# Altium project Acoustics.PrjPcb
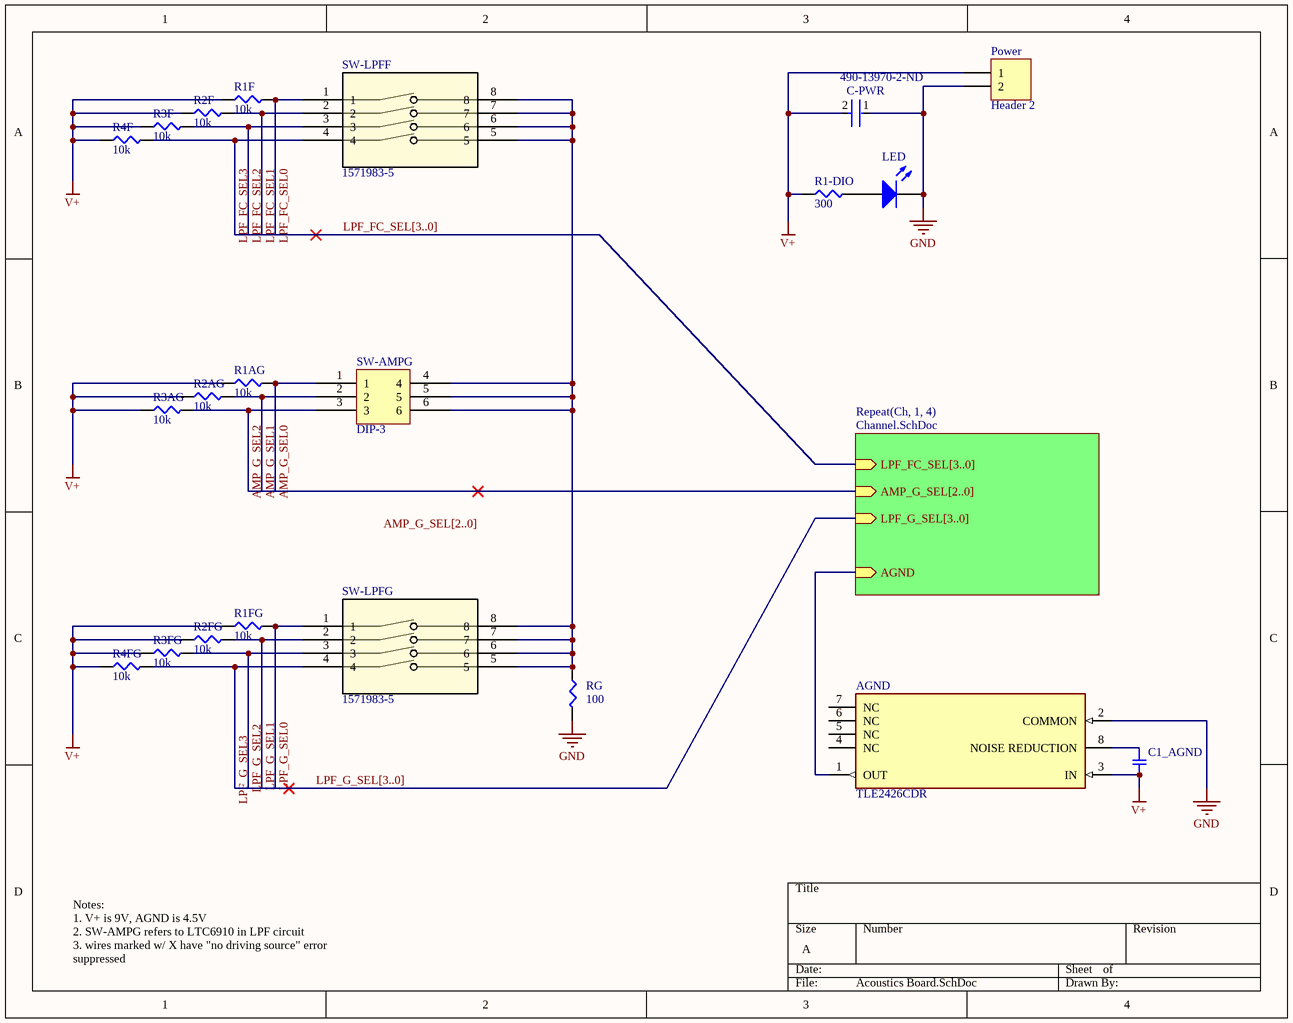
[diagram p0: Acoustics Board.SchDoc]
6 sheets, 117 parts. Net scope: hierarchical (ports join the sheet entries above them; power ports are global).
Board file: Acoustics Board.PcbDoc
Sheets:
  Acoustics Board.SchDoc
    Ch1 = Channel.SchDoc
      LPF = Low Pass Filter.SchDoc
      HPF = High Pass Filter.SchDoc
      BB = BufferBias.SchDoc
      Amp = AmpCKT.SchDoc
    Ch2 = Channel.SchDoc
      LPF = Low Pass Filter.SchDoc
      HPF = High Pass Filter.SchDoc
      BB = BufferBias.SchDoc
      Amp = AmpCKT.SchDoc
    Ch3 = Channel.SchDoc
      LPF = Low Pass Filter.SchDoc
      HPF = High Pass Filter.SchDoc
      BB = BufferBias.SchDoc
      Amp = AmpCKT.SchDoc
    Ch4 = Channel.SchDoc
      LPF = Low Pass Filter.SchDoc
      HPF = High Pass Filter.SchDoc
      BB = BufferBias.SchDoc
      Amp = AmpCKT.SchDoc

## Sheet Acoustics Board.SchDoc
size A

### Parts
AGND  TLE2426CDR  [FP-D0008A-IPC_B]
C1_AGND  1µF  [SMD-0805C]  (value not drawn)
C-PWR  Supplier Part Number 1: 490-13970-2-ND  [FP-GRM31C-0_3-e0_3_0_9-IPC_C]  (hidden comment: GRM31CR60J227ME11L)
LED  150080SS75000  [0805_A]  (value not drawn)
Power  Header 2  [HDR1X2]
R1-DIO  300  [SMD-0805-RES]
R1AG  10k  [SMD-0805-RES]
R1F  10k  [SMD-0805-RES]
R1FG  10k  [SMD-0805-RES]
R2AG  10k  [SMD-0805-RES]
R2F  10k  [SMD-0805-RES]
R2FG  10k  [SMD-0805-RES]
R3AG  10k  [SMD-0805-RES]
R3F  10k  [SMD-0805-RES]
R3FG  10k  [SMD-0805-RES]
R4F  10k  [SMD-0805-RES]
R4FG  10k  [SMD-0805-RES]
RG  100  [SMD-0805-RES]
SW-AMPG  DIP-3  [DIP6]
SW-LPFF  1571983-5  [SW4_1571983_4P_TEC]
SW-LPFG  1571983-5  [SW4_1571983_4P_TEC]

### Sub-sheets
Repeat(Ch, 1, 4) = Channel.SchDoc: LPF_FC_SEL[3..0] (in), AMP_G_SEL[2..0] (in), LPF_G_SEL[3..0] (in), AGND (in)

### Nets
GND: AGND.2(COMMON) C-PWR.1 LED.1(K) Power.2 RG.2
V+: AGND.3(IN) C1_AGND.2 C-PWR.2 Power.1 R1-DIO.1 R1AG.1 R1F.1 R1FG.1 R2AG.1 R2F.1 R2FG.1 R3AG.1 R3F.1 R3FG.1 R4F.1 R4FG.1
AMP_G_SEL0: R1AG.2 SW-AMPG.1
AMP_G_SEL1: R2AG.2 SW-AMPG.2
AMP_G_SEL2: R3AG.2 SW-AMPG.3
LPF_FC_SEL0: R1F.2 SW-LPFF.1
LPF_FC_SEL1: R2F.2 SW-LPFF.2
LPF_FC_SEL2: R3F.2 SW-LPFF.3
LPF_FC_SEL3: R4F.2 SW-LPFF.4
LPF_G_SEL0: R1FG.2 SW-LPFG.1
LPF_G_SEL1: R2FG.2 SW-LPFG.2
LPF_G_SEL2: R3FG.2 SW-LPFG.3
LPF_G_SEL3: R4FG.2 SW-LPFG.4
NetAGND_1: AGND.1(OUT) ; sheet Repeat(Ch, 1, 4)/AGND
NetAGND_8: AGND.8(NOISE_REDUCTION) C1_AGND.1
NetLED_2: LED.2(A) R1-DIO.2
NetRG_1: RG.1 SW-AMPG.4 SW-AMPG.5 SW-AMPG.6 SW-LPFF.5 SW-LPFF.6 SW-LPFF.7 SW-LPFF.8 SW-LPFG.5 SW-LPFG.6 SW-LPFG.7 SW-LPFG.8

Not connected (* = marked no-connect by the designer): AGND 4(NC) 5(NC) 6(NC) 7(NC)

### Buses and harness runs
bus AMP_G_SEL[2..0]
bus LPF_FC_SEL[3..0] = sheet Repeat(Ch, 1, 4)/LPF_FC_SEL[3..0]
bus LPF_G_SEL[3..0] = sheet Repeat(Ch, 1, 4)/LPF_G_SEL[3..0]

### Notes on the sheet
- Notes:
  1. V+ is 9V, AGND is 4.5V
  2. SW-AMPG refers to LTC6910 in LPF circuit
  3. wires marked w/ X have "no driving source" error suppressed
- Labels drawn without touching a wire or pin: AMP_G_SEL[2..0]

### Library data of the parts
AGND = CMP-04916-000011-1: Ground Reference (Virtual) Voltage Reference IC Adjustable 2V 20 VV ±1% 20 mA 8-SOIC; Manufacturer: Texas Instruments; Manufacturer Part Number: TLE2426MD; Value: N/A; Operating Temperature: -55°C ~ 125°C; Datasheet Link: https://www.digikey.com/en/products/detail/texas-instruments/TLE2426MD/1676989; Package / Case: 8-SOIC; Descriptions: Ground Reference (Virtual) Voltage Reference IC Adjustable 2V 20 VV ±1% 20 mA 8-SOIC
C1_AGND = GCJ219R71C105KA01D: Manufacturer: KEMET; Manufacturer Part Number: C0805C105K3RAC7800; Descriptions: 1 µF ±10% 25V Ceramic Capacitor X7R 0805 (2012 Metric); Datasheet Link: https://api.kemet.com/component-edge/download/datasheet/C0805C105K3RACTU.pdf; Value: 1µF; Operating Temperature: -55°C ~ 125°C; Package / Case: 0805 (2012 Metric)
C-PWR = CMP-06035-000079-2: Chip Multilayer Ceramic Capacitors for General Purpose, 1206, 220uF, X5R, 15%, 20%, 6.3V; Manufacturer: Murata; Mount: Surface Mount; Width: 0.063inch; Voltage Rating: 6.3V; Packaging: Cut Tape; Dielectric: X5R; Capacitance: 220uF; Voltage Rating (DC): 6.3V; Case/Package: 1206; Thickness: 0.075inch; Tolerance: 20%; Max Operating Temperature: 85°C; Case Code (Metric): 3216; Min Operating Temperature: -55°C; Length: 0.126inch; REACH SVHC: No SVHC; Case Code (Imperial): 1206; Supplier 1: Digi-Key; Manufacturer Part Number: GRM31CR60J227ME11L; RoHS: Yes; Category: Ceramic Capacitors; Stock 1: 266877; Pricing 1: 2000=0.46209, 4000=0.44559, 10000=0.42909, 14000=0.42083 (USD); RoHS Compliant: Yes; ComponentLink1URL: http://www.farnell.com/datasheets/2867879.pdf?src-supplier=Farnell; ComponentLink1Description: http://www.farnell.com/datasheets/2867879.pdf?src-supplier=Farnell; ComponentLink2URL: http://search.murata.co.jp/Ceramy/image/img/A01X/partnumbering_e_01.pdf?src-supplier=Digi-Key; ComponentLink2Description: http://search.murata.co.jp/Ceramy/image/img/A01X/partnumbering_e_01.pdf?src-supplier=Digi-Key; ComponentLink3URL: http://search.murata.co.jp/Ceramy/image/img/A01X/G101/ENG/GRM31CR60J227ME11-01.pdf?src-supplier=Digi-Key; ComponentLink3Description: http://search.murata.co.jp/Ceramy/image/img/A01X/G101/ENG/GRM31CR60J227ME11-01.pdf?src-supplier=Digi-Key; ComponentLink4URL: http://www.farnell.com/datasheets/2867879.pdf?src-supplier=Element14; ComponentLink4Description: http://www.farnell.com/datasheets/2867879.pdf?src-supplier=Element14; ComponentLink5URL: http://www.farnell.com/datasheets/1957826.pdf?src-supplier=Newark; ComponentLink5Description: http://www.farnell.com/datasheets/1957826.pdf?src-supplier=Newark
LED = CMP-1426-00010-1: Red 630nm LED Indication - Discrete 1.9V 0805 (2012 Metric); Manufacturer: Wuerth Elektronik; Value: 1.9V; Operating Temperature: -40°C ~ 85°C; Manufacturer Part Number: 150080SS75000; Datasheet Link: https://www.we-online.com/katalog/datasheet/150080SS75000.pdf; Package / Case: 0805 (2012 Metric); Descriptions: Red 630nm LED Indication - Discrete 1.9V 0805 (2012 Metric)
R1-DIO = ERJ-6ENF1002V: Manufacturer: Stackpole Electronics Inc; Manufacturer Part Number: RNCF0805DTE300R; Descriptions: 300 Ohms ±0.5% 0.125W, 1/8W Chip Resistor 0805 (2012 Metric) Automotive AEC-Q200 Thin Film; Datasheet Link: https://www.seielect.com/catalog/sei-rncf.pdf; Value: 300; Operating Temperature: -55°C ~ 155°C; Package / Case: 0805 (2012 Metric)
R1AG R1F R1FG R2AG R2F R2FG R3AG R3F R3FG R4F R4FG = ERJ-6ENF1002V: Manufacturer: Panasonic Electronic Components; Manufacturer Part Number: RMCF0805JG10K0; Descriptions: 10 kOhms ±5% 0.125W, 1/8W Chip Resistor 0805 (2012 Metric) Automotive AEC-Q200 Thick Film; Datasheet Link: https://www.seielect.com/catalog/sei-rmcf_rmcp.pdf; Value: 10k; Operating Temperature: -55°C ~ 155°C; Package / Case: 0805 (2012 Metric)
RG = ERJ-P06F1000V: RES SMD 100 OHM 1% 1/2W 0805; Manufacturer: Panasonic Electronic Components; Factory Stock: 0; Unit Price (USD): 0.02534; @ qty: 1500; Minimum Quantity: 1; Power (Watts): 0.5W, 1/2W; Temperature Coefficient: ±100ppm/°C; Part Number: ERJ-P06F1000V; Datasheets: https://industrial.panasonic.com/cdbs/www-data/pdf/RDA0000/AOA0000C243.pdf; Image: //media.digikey.com/Renders/Panasonic%20Renders/ERJ-0805%20Pkg.jpg; Digi-Key Part Number: P16057CT-ND; Quantity Available: 28131; Packaging: Cut Tape (CT); Series: ERJ; Part Status: Active; Value: 100; Tolerance: ±1%; Composition: Thick Film; Features: Automotive AEC-Q200, Pulse Withstanding; Operating Temperature: -55°C ~ 155°C; Package / Case: 0805 (2012 Metric); Supplier Device Package: 0805; Size / Dimension: 0.079" L x 0.049" W (2.00mm x 1.25mm); Height - Seated (Max): 0.028" (0.70mm); Number of Terminations: 2; Failure Rate: -
SW-LPFF SW-LPFG = 1571983-5: No Description Available; Mfr_Name: TE Connectivity; Copyright: Copyright (C) 2022 Ultra Librarian. All rights reserved.; Manufacturer_Part_Number: 1571983-5; Digi-Key_Part_Number_1: 450-1762-1-ND; Digi-Key_Part_Number_2: 450-1762-2-ND; Digi-Key_Part_Number_3: 450-1762-6-ND; RefDes: RefDes; Type: DEV
Power = Header 2: Value: N/A; Package / Case: HDR1X2

## Sheet Channel.SchDoc
size A
Used 4 times, as channels Ch1, Ch2, Ch3, Ch4. Parts and nets are listed once, with the designators drawn on the sheet.
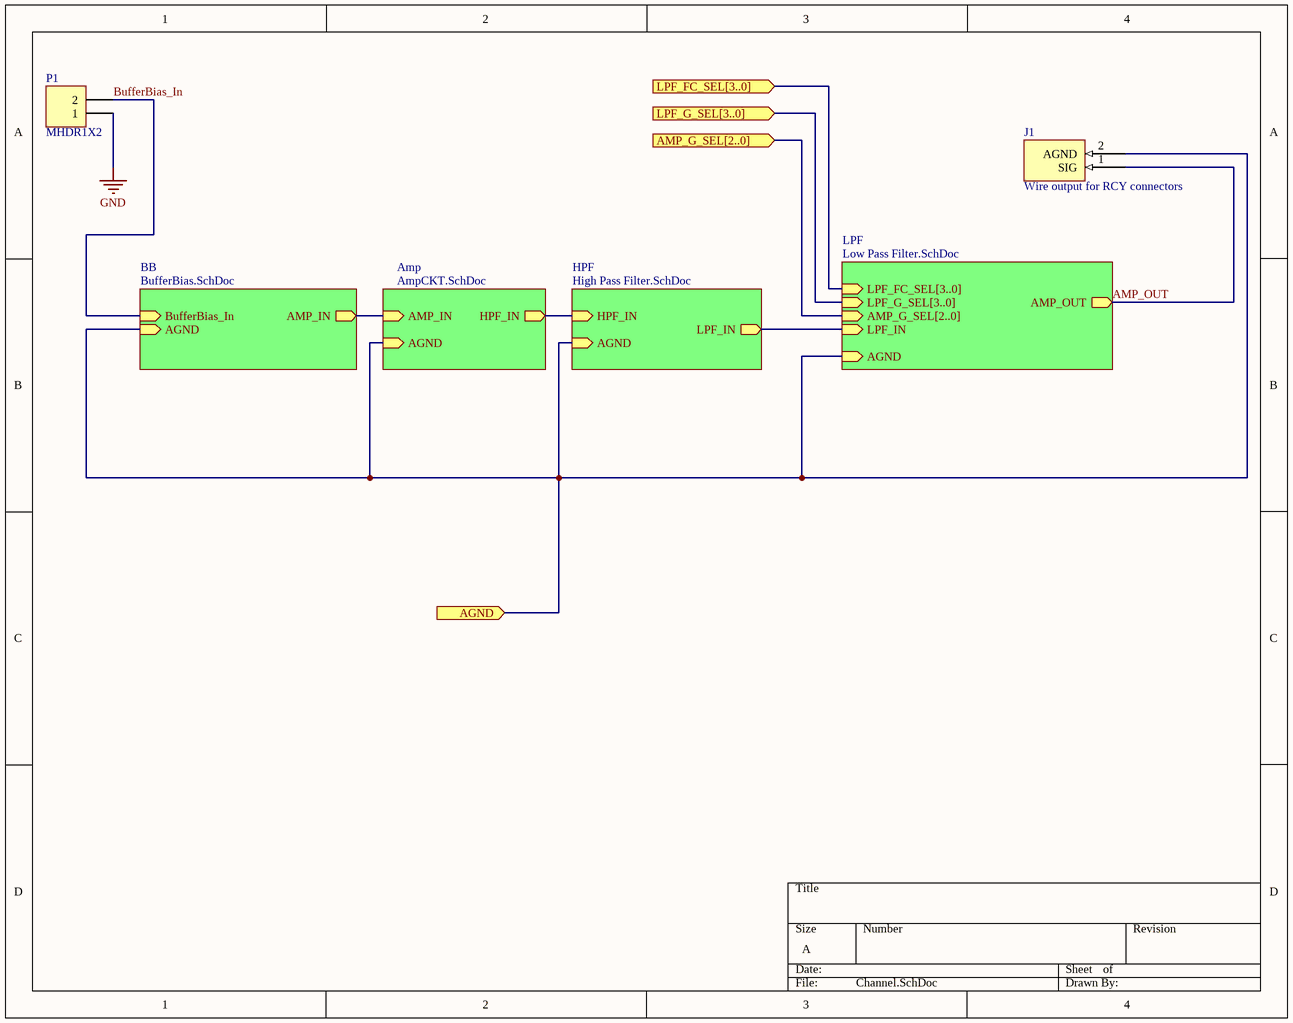
[diagram p1: Channel.SchDoc]

### Parts
J1  Wire output for RCY connectors  [WireOut]
P1  MHDR1X2  [MHDR1X2]

### Sub-sheets
Amp = AmpCKT.SchDoc: AMP_IN (in), AGND (in), HPF_IN (out)
BB = BufferBias.SchDoc: BufferBias_In (in), AGND (in), AMP_IN (out)
HPF = High Pass Filter.SchDoc: HPF_IN (in), AGND (in), LPF_IN (out)
LPF = Low Pass Filter.SchDoc: LPF_FC_SEL[3..0] (in), LPF_G_SEL[3..0] (in), AMP_G_SEL[2..0] (in), LPF_IN (in), AMP_OUT (out), AGND (in)

### Ports
AGND (in), AMP_G_SEL[2..0] (in), LPF_FC_SEL[3..0] (in), LPF_G_SEL[3..0] (in)

### Nets
GND: P1.1
AGND: J1.2(AGND) ; port AGND, sheet LPF/AGND, sheet HPF/AGND, sheet BB/AGND, sheet Amp/AGND
AMP_OUT: J1.1(SIG) ; sheet LPF/AMP_OUT
BufferBias_In: P1.2 ; sheet BB/BufferBias_In
(unnamed): sheet LPF/LPF_IN, sheet HPF/LPF_IN
(unnamed): sheet HPF/HPF_IN, sheet Amp/HPF_IN
(unnamed): sheet BB/AMP_IN, sheet Amp/AMP_IN

### Channels
Ch1: designators end in _Ch1; ports AGND=NetAGND_1
Ch2: designators end in _Ch2; ports AGND=NetAGND_1
Ch3: designators end in _Ch3; ports AGND=NetAGND_1
Ch4: designators end in _Ch4; ports AGND=NetAGND_1

### Buses and harness runs
bus port AMP_G_SEL[2..0] = sheet LPF/AMP_G_SEL[2..0]
bus port LPF_FC_SEL[3..0] = sheet LPF/LPF_FC_SEL[3..0]
bus port LPF_G_SEL[3..0] = sheet LPF/LPF_G_SEL[3..0]

### Library data of the parts
J1 = WireOut: Manufacturer: JST Sales America Inc.; Manufacturer Part Number: SYP-02T-1; Descriptions: 2 Rectangular Connectors - Housings Plug Red 0.098" (2.50mm); Value: N/A; Package / Case: N/A Through Hole; Datasheet Link: https://www.jst-mfg.com/product/pdf/eng/eRCY.pdf
P1 = MHDR1X2: Value: N/A; Package / Case: MHDR1X2

## Sheet Low Pass Filter.SchDoc
size A
Used 4 times, as channels Ch1/LPF, Ch2/LPF, Ch3/LPF, Ch4/LPF. Parts and nets are listed once, with the designators drawn on the sheet.
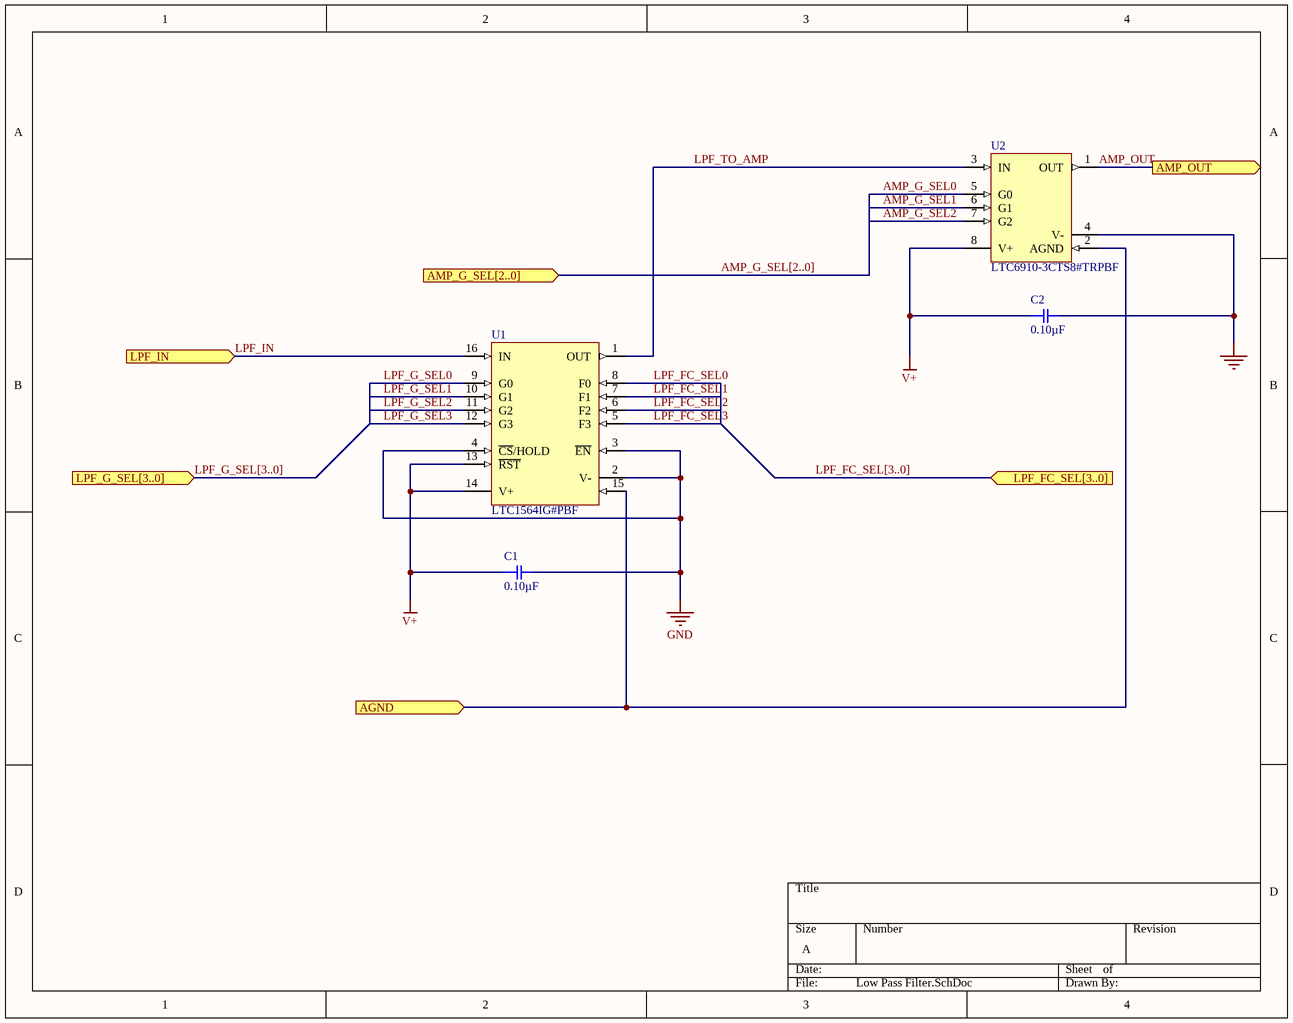
[diagram p2: Low Pass Filter.SchDoc]

### Parts
C1  0.10µF  [SMD-0805C]
C2  0.10µF  [SMD-0805C]
U1  LTC1564IG#PBF  [LT-G-16_M]
U2  LTC6910-3CTS8#TRPBF  [LT-TS8-8-TSOT-23_V]

### Ports
AGND (in), AMP_G_SEL[2..0] (in), AMP_OUT (out), LPF_FC_SEL[3..0] (in), LPF_G_SEL[3..0] (in), LPF_IN (in)

### Nets
GND: C1.2 C2.2 U1.2(V-) U1.3(~{EN}) U1.4(~{CS}/HOLD) U2.4(V-)
V+: C1.1 C2.1 U1.13(~{RST}) U1.14(V+) U2.8(V+)
AGND: U1.15(AGND) U2.2(AGND) ; port AGND
AMP_G_SEL0: U2.5(G0)
AMP_G_SEL1: U2.6(G1)
AMP_G_SEL2: U2.7(G2)
AMP_OUT: U2.1(OUT) ; port AMP_OUT
LPF_FC_SEL0: U1.8(F0)
LPF_FC_SEL1: U1.7(F1)
LPF_FC_SEL2: U1.6(F2)
LPF_FC_SEL3: U1.5(F3)
LPF_G_SEL0: U1.9(G0)
LPF_G_SEL1: U1.10(G1)
LPF_G_SEL2: U1.11(G2)
LPF_G_SEL3: U1.12(G3)
LPF_IN: U1.16(IN) ; port LPF_IN
LPF_TO_AMP: U1.1(OUT) U2.3(IN)

### Channels
Ch1/LPF: designators end in _LPF1; ports AGND=NetAGND_1 AMP_OUT=AMP_OUT_Ch1 LPF_IN=LPF_IN
Ch2/LPF: designators end in _LPF2; ports AGND=NetAGND_1 AMP_OUT=AMP_OUT_Ch2 LPF_IN=LPF_IN
Ch3/LPF: designators end in _LPF3; ports AGND=NetAGND_1 AMP_OUT=AMP_OUT_Ch3 LPF_IN=LPF_IN
Ch4/LPF: designators end in _LPF4; ports AGND=NetAGND_1 AMP_OUT=AMP_OUT_Ch4 LPF_IN=LPF_IN

### Buses and harness runs
bus AMP_G_SEL[2..0] = port AMP_G_SEL[2..0]
bus LPF_FC_SEL[3..0] = port LPF_FC_SEL[3..0]
bus LPF_G_SEL[3..0] = port LPF_G_SEL[3..0]

### Library data of the parts
C1 C2 = GCD21BR71H104KA01L: Manufacturer: KEMET; Manufacturer Part Number: C0805C104K3RAC7800; Descriptions: 0.1 µF ±10% 25V Ceramic Capacitor X7R 0805 (2012 Metric); Datasheet Link: https://api.kemet.com/component-edge/download/datasheet/C0805C104K3RACTU.pdf; Value: 0.10µF; Operating Temperature: -55°C ~ 125°C; Package / Case: 0805 (2012 Metric)
U1 = CMP-0359-00059-2: Manufacturer: Analog Devices Inc.; Descriptions: Antialiasing Filter IC Antialiasing 8th Order 150kHz 16-SSOP; RoHS: Pb-Free; Value: N/A; Operating Temperature: -40°C ~ 85°C; Datasheet Link: https://www.analog.com/media/en/technical-documentation/data-sheets/1564fa.pdf; Manufacturer Part Number: LTC1564IG#PBF; Package / Case: 16-SSOP
U2 = CMP-0359-03721-2: Manufacturer: Analog Devices Inc.; Manufacturer Part Number: LTC6910-3CTS8#TRMPBF; Descriptions: Programmable Gain Amplifier 1 Circuit Rail-to-Rail TSOT-23-8; RoHS: Pb-Free; Value: N/A; Operating Temperature: 0°C ~ 70°C; Datasheet Link: https://www.analog.com/media/en/technical-documentation/data-sheets/6910fb.pdf; Package / Case: TSOT-23-8

## Sheet High Pass Filter.SchDoc
size A
Used 4 times, as channels Ch1/HPF, Ch2/HPF, Ch3/HPF, Ch4/HPF. Parts and nets are listed once, with the designators drawn on the sheet.
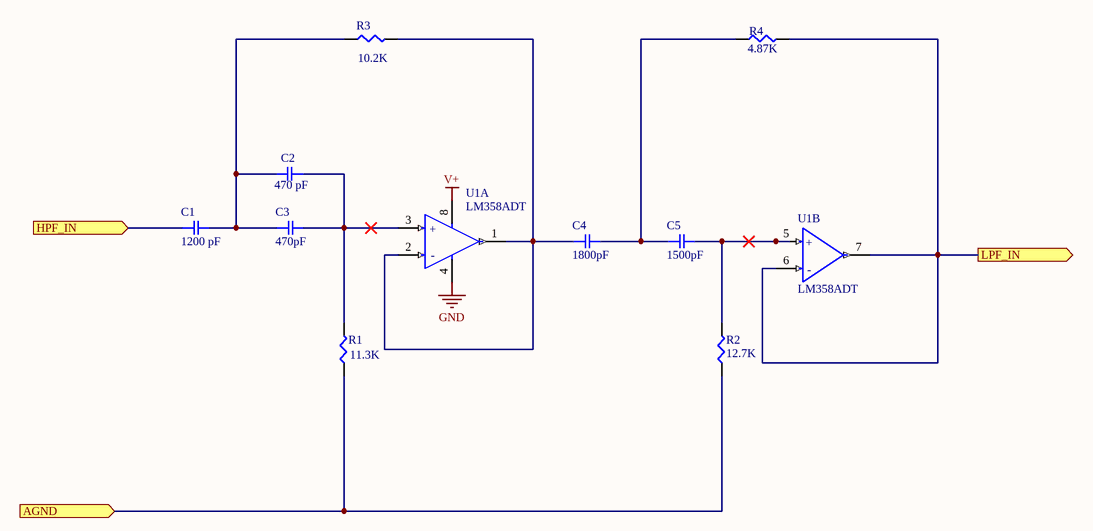
[diagram p3: High Pass Filter.SchDoc]

### Parts
C1  1200 pF  [SMD-0805C]
C2  470 pF  [SMD-0805C]
C3  470pF  [SMD-0805C]
C4  1800pF  [SMD-0805C]
C5  1500pF  [SMD-0805C]
R1  11.3K  [SMD-0805-RES]
R2  12.7K  [SMD-0805-RES]
R3  10.2K  [SMD-0805-RES]
R4  4.87K  [SMD-0805-RES]
U1  LM358ADT  [FP-SO8-IPC_C]  (parts A,B of 2)

### Ports
AGND (in), HPF_IN (in), LPF_IN (out)

### Nets
GND: U1.4(VCC-)
V+: U1.8(VCC+)
AGND: R1.1 R2.1 ; port AGND
HPF_IN: C1.1 ; port HPF_IN
LPF_IN: R4.2 U1.6(In2-) U1.7(Out2) ; port LPF_IN
NetC1_2: C1.2 C2.2 C3.1 R3.1
NetC2_1: C2.1 C3.2 R1.2 U1.3(In1+)
NetC4_1: C4.1 R3.2 U1.1(Out1) U1.2(In1-)
NetC4_2: C4.2 C5.1 R4.1
NetC5_2: C5.2 R2.2 U1.5(In2+)

### Channels
Ch1/HPF: designators end in _HPF1; ports AGND=NetAGND_1 HPF_IN=NetC1_HPF1_1 LPF_IN=LPF_IN
Ch2/HPF: designators end in _HPF2; ports AGND=NetAGND_1 HPF_IN=NetC1_HPF2_1 LPF_IN=LPF_IN
Ch3/HPF: designators end in _HPF3; ports AGND=NetAGND_1 HPF_IN=NetC1_HPF3_1 LPF_IN=LPF_IN
Ch4/HPF: designators end in _HPF4; ports AGND=NetAGND_1 HPF_IN=NetC1_HPF4_1 LPF_IN=LPF_IN

### Notes on the sheet
- (in symbol CMP-12131-000002-1, part A) +; -
- (in symbol CMP-12131-000002-1, part B) +; -

### Library data of the parts
C1 = GRM216R71E122KA01D: Manufacturer: KEMET; Manufacturer Part Number: C0805C122J2GAC7800; Value: 1200pF; Descriptions: 1200 pF ±5% 200V Ceramic Capacitor C0G, NP0 0805 (2012 Metric); Datasheet Link: https://api.kemet.com/component-edge/download/datasheet/C0805C122J2GAC7800.pdf; Operating Temperature: -55°C ~ 125°C; Package / Case: 0805 (2012 Metric)
C2 = GCM2165C1H471JA16D: Manufacturer: KEMET; Manufacturer Part Number: C0805C471J1GAC7800; Value: 470pF; Descriptions: 470 pF ±5% 100V Ceramic Capacitor C0G, NP0 0805 (2012 Metric); Datasheet Link: https://api.kemet.com/component-edge/download/datasheet/C0805C471J1GACTU.pdf; Operating Temperature: -55°C ~ 125°C; Package / Case: 0805 (2012 Metric)
C3 = GCM2165C1H471JA16D: Manufacturer: KEMET; Manufacturer Part Number: C0805C471J1GAC7800; Descriptions: 470 pF ±5% 100V Ceramic Capacitor C0G, NP0 0805 (2012 Metric); Datasheet Link: https://api.kemet.com/component-edge/download/datasheet/C0805C471J1GACTU.pdf; Value: 470pF; Operating Temperature: -55°C ~ 125°C; Package / Case: 0805 (2012 Metric)
C4 = GRM216R71E182KA01D: Manufacturer: KEMET; Manufacturer Part Number: C0805C182K5RAC7800; Descriptions: 1800 pF ±10% 50V Ceramic Capacitor X7R 0805 (2012 Metric); Datasheet Link: https://api.kemet.com/component-edge/download/datasheet/C0805C182K5RACTU.pdf; Value: 1800pF; Operating Temperature: -55°C ~ 125°C; Package / Case: 0805 (2012 Metric)
C5 = GCJ216R71H152KA01D: Manufacturer: KEMET; Manufacturer Part Number: C0805C152JAGAC7800; Descriptions: 1500 pF ±5% 250V Ceramic Capacitor C0G, NP0 0805 (2012 Metric); Datasheet Link: https://api.kemet.com/component-edge/download/datasheet/C0805C152JAGAC7800.pdf; Value: 1500pF; Operating Temperature: -55°C ~ 125°C; Package / Case: 0805 (2012 Metric)
R1 = ERJ-6ENF1132V: Manufacturer: Stackpole Electronics Inc; Manufacturer Part Number: RNCF0805DTE11K3; Descriptions: 11.3 kOhms ±0.5% 0.125W, 1/8W Chip Resistor 0805 (2012 Metric) Automotive AEC-Q200 Thin Film; Datasheet Link: https://www.seielect.com/catalog/sei-rncf.pdf; Value: 11.3k; Operating Temperature: -55°C ~ 155°C; Package / Case: 0805 (2012 Metric)
R2 = ERJ-6ENF1272V: Manufacturer: Stackpole Electronics Inc; Manufacturer Part Number: RNCF0805DTE12K7; Descriptions: 12.7 kOhms ±0.5% 0.125W, 1/8W Chip Resistor 0805 (2012 Metric) Automotive AEC-Q200 Thin Film; Datasheet Link: https://www.seielect.com/catalog/sei-rncf.pdf; Value: 12.7k; Operating Temperature: -55°C ~ 155°C; Package / Case: 0805 (2012 Metric)
R3 = ERJ-6ENF1022V: Manufacturer: Stackpole Electronics Inc; Manufacturer Part Number: RNCF0805DTE10K2; Descriptions: 10.2 kOhms ±0.5% 0.125W, 1/8W Chip Resistor 0805 (2012 Metric) Automotive AEC-Q200 Thin Film; Datasheet Link: https://www.seielect.com/catalog/sei-rncf.pdf; Value: 10.2k; Operating Temperature: -55°C ~ 155°C; Package / Case: 0805 (2012 Metric)
R4 = ERJ-6ENF4871V: Manufacturer: Stackpole Electronics Inc; Manufacturer Part Number: RMCF0805FT4K87; Descriptions: 4.87 kOhms ±1% 0.125W, 1/8W Chip Resistor 0805 (2012 Metric) Automotive AEC-Q200 Thick Film; Datasheet Link: https://www.seielect.com/catalog/sei-rmcf_rmcp.pdf; Value: 4.87k; Operating Temperature: -55°C ~ 155°C; Package / Case: 0805 (2012 Metric)
U1 = CMP-12131-000002-1: Manufacturer Part Number: LM358WDT; Manufacturer: STMicroelectronics; Descriptions: General Purpose Amplifier 2 Circuit - 8-SOIC; RoHS: TRUE; Value: N/A; Operating Temperature: 0°C ~ 70°C; Datasheet Link: https://www.st.com/content/ccc/resource/technical/document/datasheet/82/55/37/12/85/cc/4c/29/CD00003160.pdf/files/CD00003160.pdf/jcr:content/translations/en.CD00003160.pdf; Package / Case: 8-SOIC

## Sheet BufferBias.SchDoc
size A
Used 4 times, as channels Ch1/BB, Ch2/BB, Ch3/BB, Ch4/BB. Parts and nets are listed once, with the designators drawn on the sheet.
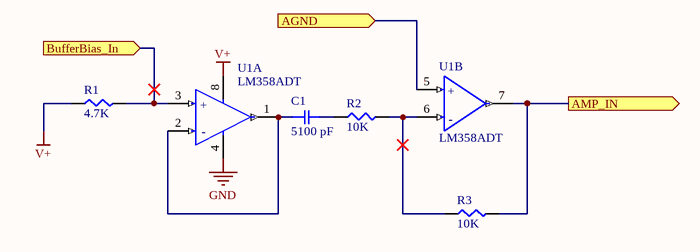
[diagram p4: BufferBias.SchDoc]

### Parts
C1  5100 pF  [SMD-0805C]
R1  4.7K  [SMD-0805-RES]
R2  10K  [SMD-0805-RES]
R3  10K  [SMD-0805-RES]
U1  LM358ADT  [FP-SO8-IPC_C]  (parts A,B of 2)

### Ports
AGND (in), AMP_IN (out), BufferBias_In (in)

### Nets
GND: U1.4(VCC-)
V+: R1.1 U1.8(VCC+)
AGND: U1.5(In2+) ; port AGND
AMP_IN: R3.2 U1.7(Out2) ; port AMP_IN
BufferBias_In: R1.2 U1.3(In1+) ; port BufferBias_In
NetC1_1: C1.1 U1.1(Out1) U1.2(In1-)
NetC1_2: C1.2 R2.1
NetR2_2: R2.2 R3.1 U1.6(In2-)

### Channels
Ch1/BB: designators end in _BB1; ports AGND=NetAGND_1 AMP_IN=NetR3_BB1_2 BufferBias_In=BufferBias_In_Ch1
Ch2/BB: designators end in _BB2; ports AGND=NetAGND_1 AMP_IN=NetR3_BB2_2 BufferBias_In=BufferBias_In_Ch2
Ch3/BB: designators end in _BB3; ports AGND=NetAGND_1 AMP_IN=NetR3_BB3_2 BufferBias_In=BufferBias_In_Ch3
Ch4/BB: designators end in _BB4; ports AGND=NetAGND_1 AMP_IN=NetR3_BB4_2 BufferBias_In=BufferBias_In_Ch4

### Notes on the sheet
- (in symbol CMP-12131-000002-1, part A) +; -
- (in symbol CMP-12131-000002-1, part B) +; -

### Library data of the parts
C1 = GRM2195C1H512JA01D: Manufacturer: KEMET; Manufacturer Part Number: C0805C512F4HACAUTO; Value: 5100pF; Descriptions: 5100 pF ±1% 16V Ceramic Capacitor X8R 0805 (2012 Metric); Datasheet Link: https://content.kemet.com/datasheets/KEM_C1007_X8R_ULTRA_150C_SMD.pdf; Operating Temperature: -55°C ~ 125°C; Package / Case: 0805 (2012 Metric)
R1 = ERJ-6ENF4701V: Manufacturer: Stackpole Electronics Inc; Manufacturer Part Number: RNCF0805DTE4K70; Descriptions: RES 4.7K OHM 0.5% 1/8W 0805; Datasheet Link: https://www.seielect.com/catalog/sei-rncf.pdf; Value: 4.7k; Operating Temperature: -55°C ~ 155°C; Package / Case: 0805 (2012 Metric)
R2 R3 = ERJ-6ENF1002V: Manufacturer: Stackpole Electronics Inc; Manufacturer Part Number: RMCF0805JG10K0; Descriptions: 10 kOhms ±5% 0.125W, 1/8W Chip Resistor 0805 (2012 Metric) Automotive AEC-Q200 Thick Film; Datasheet Link: https://www.seielect.com/catalog/sei-rmcf_rmcp.pdf; Value: 10k; Operating Temperature: -55°C ~ 155°C; Package / Case: 0805 (2012 Metric)
U1 = CMP-12131-000002-1: as U1 on sheet High Pass Filter; RoHS: TRUE; Value: N/A; Operating Temperature: 0°C ~ 70°C; Datasheet Link: https://www.st.com/content/ccc/resource/technical/document/datasheet/82/55/37/12/85/cc/4c/29/CD00003160.pdf/files/CD00003160.pdf/jcr:content/translations/en.CD00003160.pdf; Package / Case: 8-SOIC

## Sheet AmpCKT.SchDoc
size A
Used 4 times, as channels Ch1/Amp, Ch2/Amp, Ch3/Amp, Ch4/Amp. Parts and nets are listed once, with the designators drawn on the sheet.
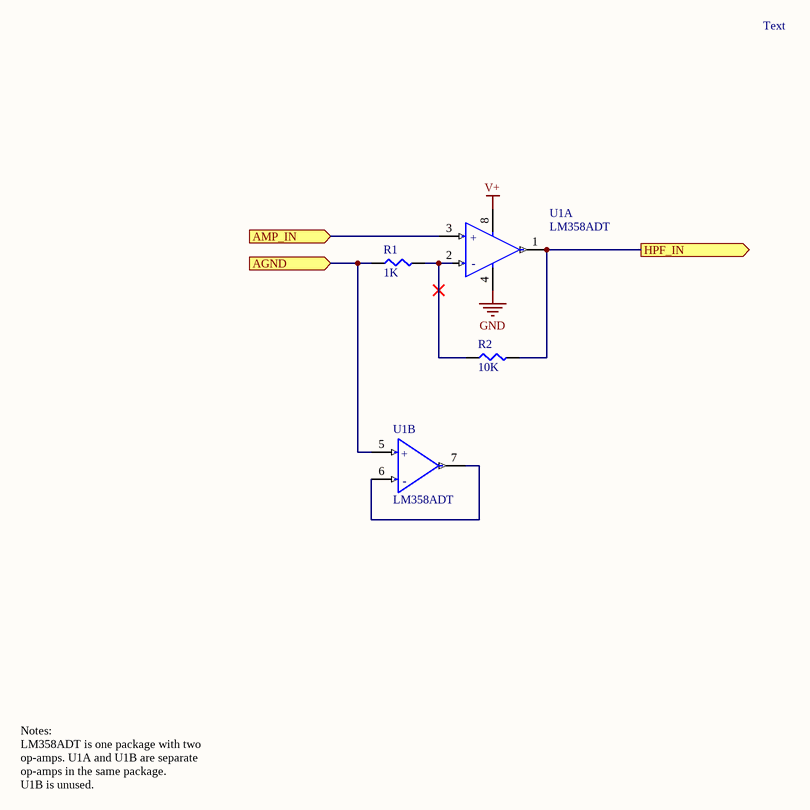
[diagram p5: AmpCKT.SchDoc]

### Parts
R1  1K  [SMD-0805-RES]
R2  10K  [SMD-0805-RES]
U1  LM358ADT  [FP-SO8-IPC_C]  (parts A,B of 2)

### Ports
AGND (in), AMP_IN (in), HPF_IN (out)

### Nets
GND: U1.4(VCC-)
V+: U1.8(VCC+)
AGND: R1.1 U1.5(In2+) ; port AGND
AMP_IN: U1.3(In1+) ; port AMP_IN
HPF_IN: R2.2 U1.1(Out1) ; port HPF_IN
NetR1_2: R1.2 R2.1 U1.2(In1-)
NetU1_6: U1.6(In2-) U1.7(Out2)

### Channels
Ch1/Amp: designators end in _Amp1; ports AGND=NetAGND_1 AMP_IN=NetR3_BB1_2 HPF_IN=NetC1_HPF1_1
Ch2/Amp: designators end in _Amp2; ports AGND=NetAGND_1 AMP_IN=NetR3_BB2_2 HPF_IN=NetC1_HPF2_1
Ch3/Amp: designators end in _Amp3; ports AGND=NetAGND_1 AMP_IN=NetR3_BB3_2 HPF_IN=NetC1_HPF3_1
Ch4/Amp: designators end in _Amp4; ports AGND=NetAGND_1 AMP_IN=NetR3_BB4_2 HPF_IN=NetC1_HPF4_1

### Notes on the sheet
- Text
- Notes:
  LM358ADT is one package with two op-amps. U1A and U1B are separate op-amps in the same package.
  U1B is unused.
- (in symbol CMP-12131-000002-1, part A) +; -
- (in symbol CMP-12131-000002-1, part B) +; -

### Library data of the parts
R1 = ERJ-6ENF1001V: Manufacturer: Stackpole Electronics Inc; Manufacturer Part Number: RMCF0805FT1K00; Descriptions: 1 kOhms ±1% 0.125W, 1/8W Chip Resistor 0805 (2012 Metric) Automotive AEC-Q200 Thick Film; Datasheet Link: https://www.seielect.com/catalog/sei-rmcf_rmcp.pdf; Value: 1k; Operating Temperature: -55°C ~ 155°C; Package / Case: 0805 (2012 Metric)
R2 = ERJ-6ENF1002V: as R2 on sheet BufferBias; Datasheet Link: https://www.seielect.com/catalog/sei-rmcf_rmcp.pdf; Value: 10k; Operating Temperature: -55°C ~ 155°C; Package / Case: 0805 (2012 Metric)
U1 = CMP-12131-000002-1: as U1 on sheet High Pass Filter; RoHS: TRUE; Operating Temperature: 0°C ~ 70°C; Datasheet Link: https://www.st.com/content/ccc/resource/technical/document/datasheet/82/55/37/12/85/cc/4c/29/CD00003160.pdf/files/CD00003160.pdf/jcr:content/translations/en.CD00003160.pdf; Package / Case: 8-SOIC

## Nets that join several sheets
GND: Acoustics Board (5 pins), Ch1 (P1_Ch1.1), Ch1/LPF (6 pins), Ch1/HPF (U1_HPF1.4), Ch1/BB (U1_BB1.4), Ch1/Amp (U1_Amp1.4), Ch2 (P1_Ch2.1), Ch2/LPF (6 pins), Ch2/HPF (U1_HPF2.4), Ch2/BB (U1_BB2.4), Ch2/Amp (U1_Amp2.4), Ch3 (P1_Ch3.1), Ch3/LPF (6 pins), Ch3/HPF (U1_HPF3.4), Ch3/BB (U1_BB3.4), Ch3/Amp (U1_Amp3.4), Ch4 (P1_Ch4.1), Ch4/LPF (6 pins), Ch4/HPF (U1_HPF4.4), Ch4/BB (U1_BB4.4), Ch4/Amp (U1_Amp4.4)
V+: Acoustics Board (16 pins), Ch1/LPF (5 pins), Ch1/HPF (U1_HPF1.8), Ch1/BB (R1_BB1.1 U1_BB1.8), Ch1/Amp (U1_Amp1.8), Ch2/LPF (5 pins), Ch2/HPF (U1_HPF2.8), Ch2/BB (R1_BB2.1 U1_BB2.8), Ch2/Amp (U1_Amp2.8), Ch3/LPF (5 pins), Ch3/HPF (U1_HPF3.8), Ch3/BB (R1_BB3.1 U1_BB3.8), Ch3/Amp (U1_Amp3.8), Ch4/LPF (5 pins), Ch4/HPF (U1_HPF4.8), Ch4/BB (R1_BB4.1 U1_BB4.8), Ch4/Amp (U1_Amp4.8)
AMP_G_SEL0: Ch1/LPF (U2_LPF1.5), Ch2/LPF (U2_LPF2.5), Ch3/LPF (U2_LPF3.5), Ch4/LPF (U2_LPF4.5)
AMP_G_SEL1: Ch1/LPF (U2_LPF1.6), Ch2/LPF (U2_LPF2.6), Ch3/LPF (U2_LPF3.6), Ch4/LPF (U2_LPF4.6)
AMP_G_SEL2: Ch1/LPF (U2_LPF1.7), Ch2/LPF (U2_LPF2.7), Ch3/LPF (U2_LPF3.7), Ch4/LPF (U2_LPF4.7)
AMP_OUT_Ch1: Ch1 (J1_Ch1.1), Ch1/LPF (U2_LPF1.1)
AMP_OUT_Ch2: Ch2 (J1_Ch2.1), Ch2/LPF (U2_LPF2.1)
AMP_OUT_Ch3: Ch3 (J1_Ch3.1), Ch3/LPF (U2_LPF3.1)
AMP_OUT_Ch4: Ch4 (J1_Ch4.1), Ch4/LPF (U2_LPF4.1)
BufferBias_In_Ch1: Ch1 (P1_Ch1.2), Ch1/BB (R1_BB1.2 U1_BB1.3)
BufferBias_In_Ch2: Ch2 (P1_Ch2.2), Ch2/BB (R1_BB2.2 U1_BB2.3)
BufferBias_In_Ch3: Ch3 (P1_Ch3.2), Ch3/BB (R1_BB3.2 U1_BB3.3)
BufferBias_In_Ch4: Ch4 (P1_Ch4.2), Ch4/BB (R1_BB4.2 U1_BB4.3)
LPF_FC_SEL0: Acoustics Board (R1F.2 SW-LPFF.1), Ch1/LPF (U1_LPF1.8), Ch2/LPF (U1_LPF2.8), Ch3/LPF (U1_LPF3.8), Ch4/LPF (U1_LPF4.8)
LPF_FC_SEL1: Acoustics Board (R2F.2 SW-LPFF.2), Ch1/LPF (U1_LPF1.7), Ch2/LPF (U1_LPF2.7), Ch3/LPF (U1_LPF3.7), Ch4/LPF (U1_LPF4.7)
LPF_FC_SEL2: Acoustics Board (R3F.2 SW-LPFF.3), Ch1/LPF (U1_LPF1.6), Ch2/LPF (U1_LPF2.6), Ch3/LPF (U1_LPF3.6), Ch4/LPF (U1_LPF4.6)
LPF_FC_SEL3: Acoustics Board (R4F.2 SW-LPFF.4), Ch1/LPF (U1_LPF1.5), Ch2/LPF (U1_LPF2.5), Ch3/LPF (U1_LPF3.5), Ch4/LPF (U1_LPF4.5)
LPF_G_SEL0: Acoustics Board (R1FG.2 SW-LPFG.1), Ch1/LPF (U1_LPF1.9), Ch2/LPF (U1_LPF2.9), Ch3/LPF (U1_LPF3.9), Ch4/LPF (U1_LPF4.9)
LPF_G_SEL1: Acoustics Board (R2FG.2 SW-LPFG.2), Ch1/LPF (U1_LPF1.10), Ch2/LPF (U1_LPF2.10), Ch3/LPF (U1_LPF3.10), Ch4/LPF (U1_LPF4.10)
LPF_G_SEL2: Acoustics Board (R3FG.2 SW-LPFG.3), Ch1/LPF (U1_LPF1.11), Ch2/LPF (U1_LPF2.11), Ch3/LPF (U1_LPF3.11), Ch4/LPF (U1_LPF4.11)
LPF_G_SEL3: Acoustics Board (R4FG.2 SW-LPFG.4), Ch1/LPF (U1_LPF1.12), Ch2/LPF (U1_LPF2.12), Ch3/LPF (U1_LPF3.12), Ch4/LPF (U1_LPF4.12)
LPF_IN: Ch1/LPF (U1_LPF1.16), Ch1/HPF (R4_HPF1.2 U1_HPF1.6 U1_HPF1.7)
LPF_IN: Ch2/LPF (U1_LPF2.16), Ch2/HPF (R4_HPF2.2 U1_HPF2.6 U1_HPF2.7)
LPF_IN: Ch3/LPF (U1_LPF3.16), Ch3/HPF (R4_HPF3.2 U1_HPF3.6 U1_HPF3.7)
LPF_IN: Ch4/LPF (U1_LPF4.16), Ch4/HPF (R4_HPF4.2 U1_HPF4.6 U1_HPF4.7)
NetAGND_1: Acoustics Board (AGND.1), Ch1 (J1_Ch1.2), Ch1/LPF (U1_LPF1.15 U2_LPF1.2), Ch1/HPF (R1_HPF1.1 R2_HPF1.1), Ch1/BB (U1_BB1.5), Ch1/Amp (R1_Amp1.1 U1_Amp1.5), Ch2 (J1_Ch2.2), Ch2/LPF (U1_LPF2.15 U2_LPF2.2), Ch2/HPF (R1_HPF2.1 R2_HPF2.1), Ch2/BB (U1_BB2.5), Ch2/Amp (R1_Amp2.1 U1_Amp2.5), Ch3 (J1_Ch3.2), Ch3/LPF (U1_LPF3.15 U2_LPF3.2), Ch3/HPF (R1_HPF3.1 R2_HPF3.1), Ch3/BB (U1_BB3.5), Ch3/Amp (R1_Amp3.1 U1_Amp3.5), Ch4 (J1_Ch4.2), Ch4/LPF (U1_LPF4.15 U2_LPF4.2), Ch4/HPF (R1_HPF4.1 R2_HPF4.1), Ch4/BB (U1_BB4.5), Ch4/Amp (R1_Amp4.1 U1_Amp4.5)
NetC1_HPF1_1: Ch1/HPF (C1_HPF1.1), Ch1/Amp (R2_Amp1.2 U1_Amp1.1)
NetC1_HPF2_1: Ch2/HPF (C1_HPF2.1), Ch2/Amp (R2_Amp2.2 U1_Amp2.1)
NetC1_HPF3_1: Ch3/HPF (C1_HPF3.1), Ch3/Amp (R2_Amp3.2 U1_Amp3.1)
NetC1_HPF4_1: Ch4/HPF (C1_HPF4.1), Ch4/Amp (R2_Amp4.2 U1_Amp4.1)
NetR3_BB1_2: Ch1/BB (R3_BB1.2 U1_BB1.7), Ch1/Amp (U1_Amp1.3)
NetR3_BB2_2: Ch2/BB (R3_BB2.2 U1_BB2.7), Ch2/Amp (U1_Amp2.3)
NetR3_BB3_2: Ch3/BB (R3_BB3.2 U1_BB3.7), Ch3/Amp (U1_Amp3.3)
NetR3_BB4_2: Ch4/BB (R3_BB4.2 U1_BB4.7), Ch4/Amp (U1_Amp4.3)